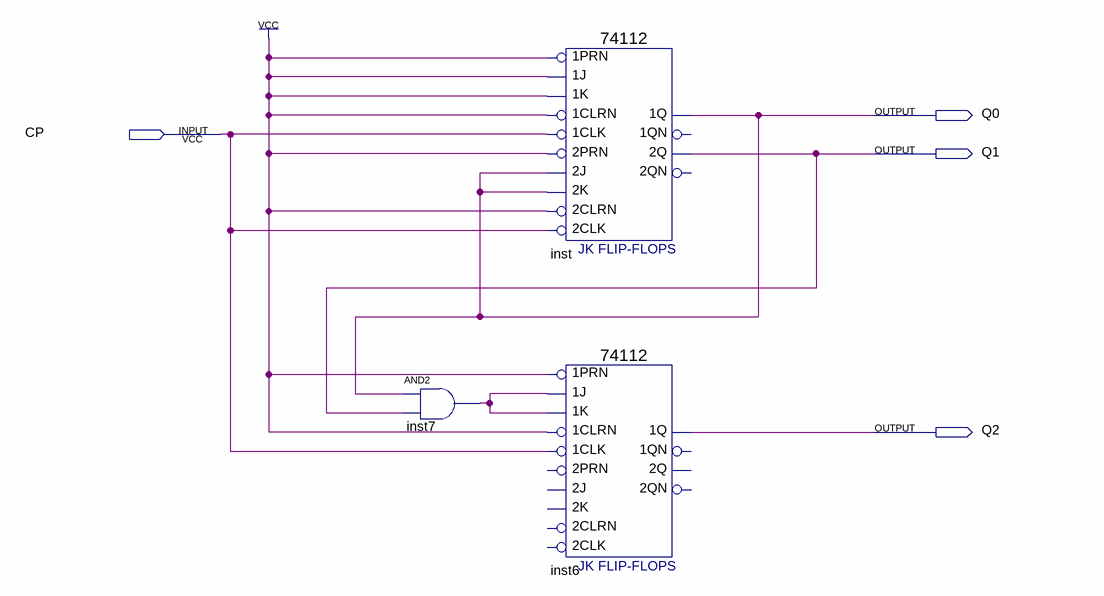
[diagram p0: schematic sheet]
// Quartus schematic 74LS112.bdf as structural Verilog: 3 symbols, 4 pins
module \74LS112  (
  input  CP,
  output Q0,
  output Q1,
  output Q2
);

  wire inst7_out;

  and inst7 (inst7_out, Q0, Q1);
  \74112  inst (
    .\1K (1'b1), .\1J (1'b1), .\1PRN (1'b1), .\1CLK (CP), .\1CLRN (1'b1), .\2K (Q0), .\2J (Q0),
    .\2PRN (1'b1), .\2CLK (CP), .\2CLRN (1'b1), .\2Q (Q1), .\1Q (Q0));  // open: 1QN, 2QN
  \74112  inst6 (
    .\1K (inst7_out), .\1J (inst7_out), .\1PRN (1'b1), .\1CLK (CP), .\1CLRN (1'b1), .\1Q (Q2));  // open: 2K, 2J, 2PRN, 2CLK, 2CLRN, 1QN, 2Q, 2QN
endmodule
